# Altium project TIDM_TM4C129CAMERA.PrjPcb
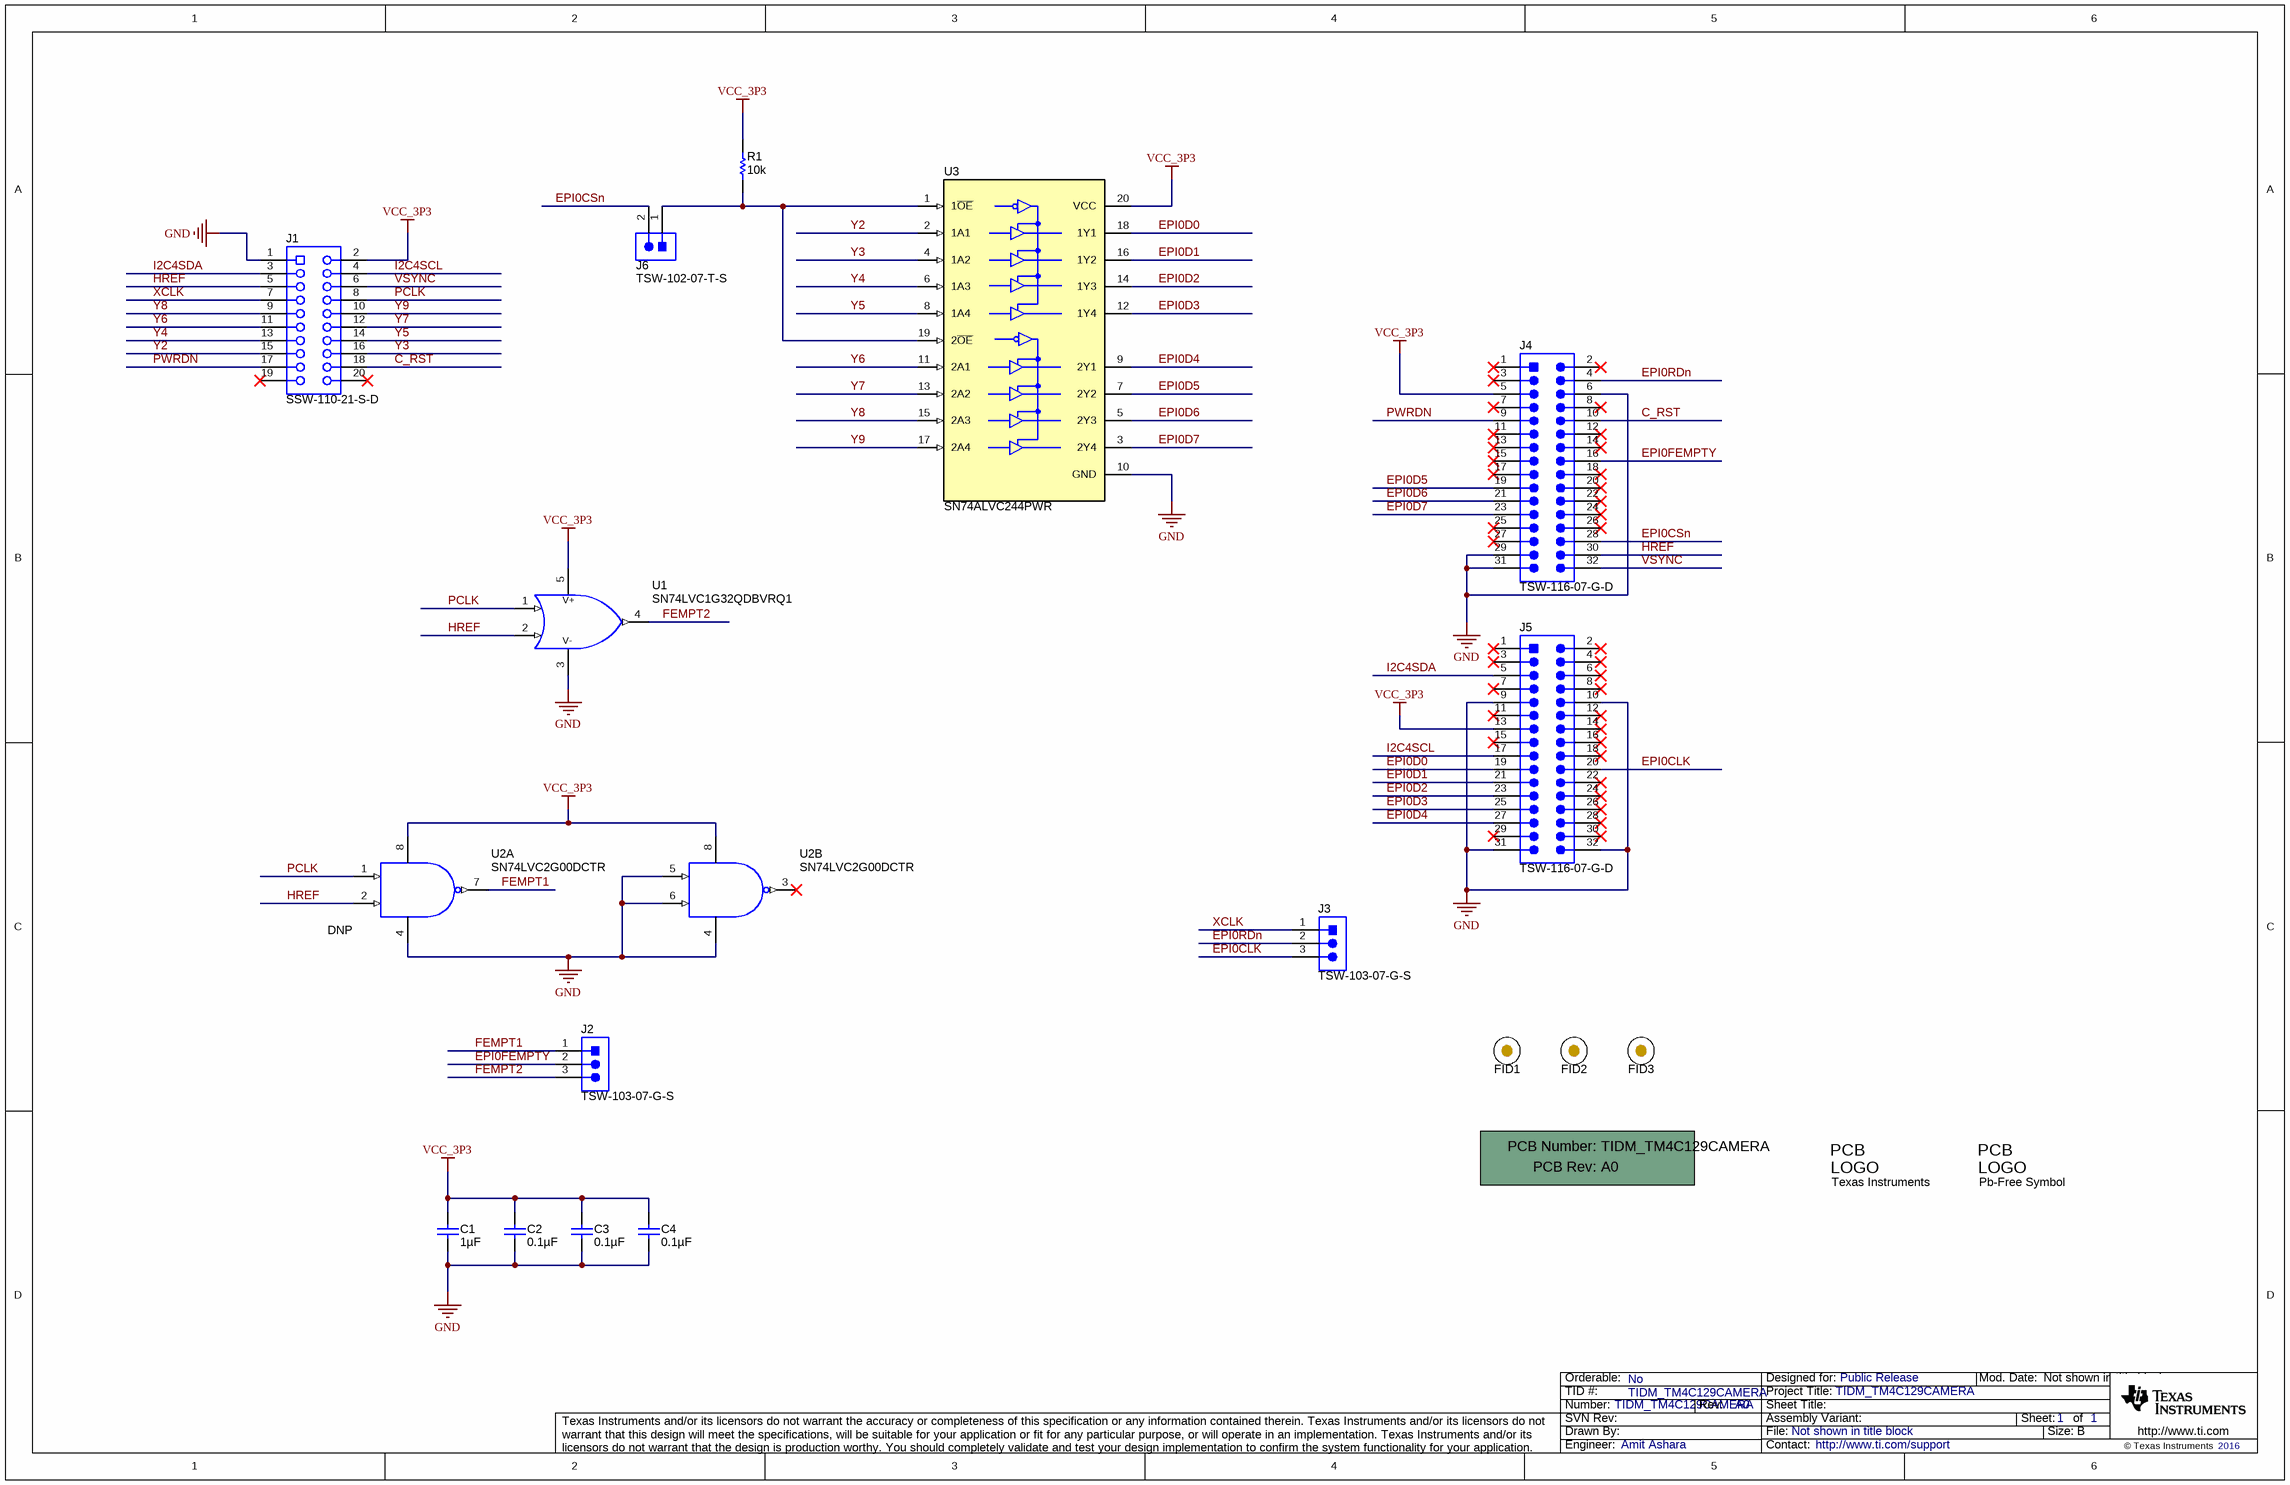
[diagram p0: TIDM_TM4C129CAMERA.SchDoc]
CopyrightYear: 2016; EVM_Orderable: No; PCB_Layout: Amit Ashara; PCB_Rev: A0; PRJ_Customer: Public Release; PRJ_Engineer: Amit Ashara; PRJ_Number: TIDM_TM4C129CAMERA; PRJ_Title: TIDM_TM4C129CAMERA; SCH_Rev: A0; TechSupport: http://www.ti.com/support; TID: TIDM_TM4C129CAMERA
1 sheet, 20 parts. Net scope: global (net labels, ports and power ports of the same name join across sheets).
Board file: TIDM_TM4C129CAMERA.PcbDoc

## Sheet TIDM_TM4C129CAMERA.SchDoc
size 431 x 279 mm; Date: Not shown in title block; ApprovedBy: Not shown in title block; CheckedBy: Not shown in title block; Author: Not shown in title block; CompanyName: Not shown in title block; Engineer: Not shown in title block; Organization: Not shown in title block; Address1: Not shown in title block; Address2: Not shown in title block; Address3: Not shown in title block; Address4: Not shown in title block; DocumentNumber: 1; Revision: Use project parameter SCH_Rev; SheetNumber: 1; SheetTotal: 1; PageSetup: Record=PageOptions|CenterHorizontal=True|CenterVertical=True|PrintScale=1.00|XCorrection=1.00|YCorrection=1.00|PrintKind=0|BorderSize=5000000|LeftOffset=0|BottomOffset=0|Orientation=2|PaperLength=1000|PaperWidth=1000|Scale=100|PaperSource=15|PrintQuality=600|MediaType=1|DitherType=10|PaperKind=Letter|PrintScaleMode=1; CurrentTime: Not shown in title block; CurrentDate: Not shown in title block; Time: Not shown in title block; DocumentFullPathAndName: Not shown in title block; DocumentName: Not shown in title block; ModifiedDate: Not shown in title block; ImagePath: Not shown in title block

### Parts
!PCB  Printed Circuit Board  (value not drawn)  (mechanical)
C1  ValueDisplayed: 1µF  [0603]  (hidden comment: GRM188R71A105KA61D)
C2  ValueDisplayed: 0.1µF  [0603]  (hidden comment: C0603C104K8RACTU)
C3  ValueDisplayed: 0.1µF  [0603]  (hidden comment: C0603C104K8RACTU)
C4  ValueDisplayed: 0.1µF  [0603]  (hidden comment: C0603C104K8RACTU)
FID1  Fiducial  [Fiducial10-20]  (value not drawn)
FID2  Fiducial  [Fiducial10-20]  (value not drawn)
FID3  Fiducial  [Fiducial10-20]  (value not drawn)
J1  SSW-110-21-S-D  [Samtec_SSW-110-x1-x-D]
J2  TSW-103-07-G-S  [TSW-103-07-G-S]
J3  TSW-103-07-G-S  [TSW-103-07-G-S]
J4  TSW-116-07-G-D  [TSW-116-07-G-D]
J5  TSW-116-07-G-D  [TSW-116-07-G-D]
J6  TSW-102-07-T-S  [Samtec_TSW-102-07-T-S]
Logo1  Texas Instruments  [TI_Stacked_Overlay_Small]  (no BOM)
Logo2  Pb-Free Symbol  [Pb-Free_Overlay_Small]  (no BOM)
R1  ValueDisplayed: 10k  [0603]  (hidden comment: CRCW060310K0JNEA)
U1  SN74LVC1G32QDBVRQ1  [DBV0005A_N]
U2  SN74LVC2G00DCTR  [DCT0008A_N]  (parts A,B of 2)
U3  SN74ALVC244PWR  [PW0020A_N]

### Nets
GND: C1.2 C2.2 C3.2 C4.2 J1.1 J4.6 J4.29 J4.31 J5.9 J5.10 J5.31 J5.32 U1.3(GND) U2.4(GND) U2.5(2A) U2.6(2B) U3.10(GND)
VCC_3P3: C1.1 C2.1 C3.1 C4.1 J1.2 J4.5 J5.13 R1.2 U1.5(VCC) U2.8(VCC) U3.20(VCC)
C_RST: J1.18 J4.10
EPI0CLK: J3.3 J5.20
EPI0CSn: J4.28 J6.2
EPI0D0: J5.19 U3.18(1Y1)
EPI0D1: J5.21 U3.16(1Y2)
EPI0D2: J5.23 U3.14(1Y3)
EPI0D3: J5.25 U3.12(1Y4)
EPI0D4: J5.27 U3.9(2Y1)
EPI0D5: J4.19 U3.7(2Y2)
EPI0D6: J4.21 U3.5(2Y3)
EPI0D7: J4.23 U3.3(2Y4)
EPI0FEMPTY: J2.2 J4.16
EPI0RDn: J3.2 J4.4
FEMPT1: J2.1 U2.7(1Y)
FEMPT2: J2.3 U1.4(Y)
HREF: J1.5 J4.30 U1.2(B) U2.2(1B)
I2C4SCL: J1.4 J5.17
I2C4SDA: J1.3 J5.5
PCLK: J1.8 U1.1(A) U2.1(1A)
PWRDN: J1.17 J4.9
VSYNC: J1.6 J4.32
XCLK: J1.7 J3.1
Y2: J1.15 U3.2(1A1)
Y3: J1.16 U3.4(1A2)
Y4: J1.13 U3.6(1A3)
Y5: J1.14 U3.8(1A4)
Y6: J1.11 U3.11(2A1)
Y7: J1.12 U3.13(2A2)
Y8: J1.9 U3.15(2A3)
Y9: J1.10 U3.17(2A4)
NetJ6_1: J6.1 R1.1 U3.1(1~{OE}) U3.19(2~{OE})

Not connected (* = marked no-connect by the designer): J1 19* 20*; J4 1* 2* 3* 7* 8* 11* 12* 13* 14* 15* 17* 18* 20* 22* 24* 25* 26* 27*; J5 1* 2* 3* 4* 6* 7* 8* 11* 12* 14* 15* 16* 18* 22* 24* 26* 28* 29* 30*; U2 3(2Y)*

### Notes on the sheet
- (near U2) DNP
- Drawn By:
- SVN Rev:
- Number:
- TID #:
- Orderable:
- Rev:
- Sheet Title:
- File:
- Project Title:
- Designed for:
- Assembly Variant:
- Mod. Date:
- Sheet:
- Size:
- of
- B
- http://www.ti.com
- Texas Instruments and/or its licensors do not warrant the accuracy or completeness of this specification or any information contained therein. Texas Instruments and/or its licensors do not warrant that this design will meet the specifications, will be suitable for your application or fit for any particular purpose, or will operate in an implementation. Texas Instruments and/or its licensors do not warrant that the design is production worthy. You should completely validate and test your design implementation to confirm the system functionality for your application.
- Engineer:
- Contact:
- © Texas Instruments
- (in symbol Pb-Free) PCB; LOGO
- (in symbol PCB) PCB Number:; PCB Rev:
- (in symbol SN74LVC1G32QDBVRQ1) V+; V-
- (in symbol TI_Logo) PCB; LOGO

### Library data of the parts
!PCB = PCB: Manufacturer: Any; PartNumber: TIDM_TM4C129CAMERA; SymbolCreator: a0412235; SymbolVersion: 2012-05-30; CompType: PCB; RoHS: O; MountType: N/A; Publisher: Texas Instruments; LatestRevisionDate: 2012-06-27; LatestRevisionNote: Initial Version; Alternate Manufacturer: -; Alternate PartNumber: -
C1 = GRM188R71A105KA61D: CAP, CERM, 1 µF, 10 V, +/- 10%, X7R, 0603; Manufacturer: MuRata; Polarized: N; CompType: Capacitor; Value: 1uF; U/M: EA; Cap_F: 0.000001; Tolerance_%: 10; ESR_ohm: 0.011; Value1: 0.011 ohm; Value2: 10V; TaMin_C: -55; TaMax_C: 125; AEC Category: Q200; SymbolVersion: 2008-07-09; PartNumber: GRM188R71A105KA61D; PackageReference: 0603; RoHS: Y; VDC_V: 10; MountType: SMT; Technology: Ceramic; TempCo: X7R; Cap_Case: 0603; Published: 2008-06-19; Publisher: Texas Instruments; LatestRevisionDate: 2016-02-23; ComponentLink1Description: Datasheet link; ComponentLink1URL: http://search.murata.co.jp/Ceramy/PnsearchViewAction.do?HnOFG=ON&HnNFG=ON&SEL_CNT=50&sLang=en&sKey=GRM188R71A105KA61D&x=9&y=9&search=startwith; Supplier 1: Digi-Key; Supplier Part Number 1: 490-3899-1-ND; Supplier 2: Mouser; Supplier Part Number 2: 81-GRM188R71A105KA1D; Supplier 3: Farnell; Supplier Part Number 3: 1845766; AEC Qualified: ?
C2-C4 = C0603C104K8RACTU: CAP, CERM, 0.1 µF, 10 V, +/- 10%, X7R, 0603; Manufacturer: Kemet; Polarized: N; CompType: Capacitor; Value: 0.1uF; U/M: EA; Cap_F: 0.0000001; Tolerance_%: 10; Value1: Unknown; Value2: 10V; TaMin_C: -55; TaMax_C: 125; AEC Category: Q200; SymbolVersion: 2008-07-09; PartNumber: C0603C104K8RACTU; PackageReference: 0603; RoHS: Y; VDC_V: 10; MountType: SMT; Technology: Ceramic; TempCo: X7R; Cap_Case: 0603; Published: 2008-06-19; Publisher: Texas Instruments; LatestRevisionDate: 2016-02-23; ComponentLink1Description: Datasheet link; ComponentLink1URL: http://www.kemet.com/kemet/web/homepage/kechome.nsf/vapubfiles/F3102_Y5V.pdf/$file/F3102_Y5V.pdf; Supplier 1: Digi-Key; Supplier Part Number 1: 399-1095-1-ND; Supplier 2: Mouser; Supplier Part Number 2: 80-C0603C104K8R; Supplier 3: Farnell; Supplier Part Number 3: 1640032; AEC Qualified: ?
FID1-FID3 = Fiducial: Fiducial mark.  There is nothing to buy or mount.; SymbolCreator: codlsc; SymbolVersion: 2009-11-4; CompType: Fiducial; Publisher: Texas Instruments; LatestRevisionDate: 2014-08-01; LatestRevisionNote: Added Alternate PartNumber and Alternate Manufacturer parameters to appropriate components.; Manufacturer: N/A; MountType: N/A; PackageReference: Fiducial; PartNumber: N/A; ClassName: FiducialMark
J1 = SSW-110-21-S-D: Receptacle, 2.54mm, 10x2, Gold, TH; Manufacturer: Samtec; SymbolCreator: a0412235; Pitch_mm: 2.54; Gender: Female; Row_Count: 2; SymbolVersion: 2013-12-20; PartNumber: SSW-110-21-S-D; PackageReference: Receptacle, 2.54mm, 10x2, TH; CompType: Receptacle; RoHS: Y; MountType: TH; ComponentLink1Description: Datasheet URL; ComponentLink1URL: https://www.samtec.com/ftppub/cpdf/SSW-1XX-XX-XXX-X-XX-XXX-XX-MKT.pdf; Orientation: Vertical; PinCount: 20; RowSpacing_mm: 2.54; ContactFinish: Gold; Color: Black; Publisher: Texas Instruments; LatestRevisionDate: 2016-02-25; Supplier 1: Digi-Key; Supplier Part Number 1: SAM1223-10-ND
J2 J3 = TSW-103-07-G-S: Header, 100mil, 3x1, Gold, TH; Manufacturer: Samtec; SymbolCreator: a0799628; Pitch_mm: 2.54; Gender: Male; Shrouded: N; Row_Count: 1; Current_A: 6.3; Voltage_V: 550; Cert_CSA: Y; SymbolVersion: 2013-03-28; PartNumber: TSW-103-07-G-S; PackageReference: 3x1 Header; ClassName: Header; CompType: Header; RoHS: Y; MountType: TH; ComponentLink1Description: Datasheet URL; ComponentLink1URL: http://samtec.com/ftppub/pdf/TSW_TH.PDF; Orientation: Vertical; PinCount: 3; ContactFinish: Gold; Color: Black; Cert_UL: Y; Cert_CULUS: N; Cert_VDE: N; Publisher: Texas Instruments; LatestRevisionDate: 2016-02-25; Supplier 1: Digi-Key; Supplier Part Number 1: SAM1029-03-ND
J4 J5 = TSW-116-07-G-D: Header, 100mil, 16x2, Gold, TH; Manufacturer: Samtec; SymbolCreator: a0412235; Pitch_mm: 2.54; Gender: Male; Shrouded: N; Row_Count: 2; Current_A: 6.3; Voltage_V: 550; Cert_CSA: Y; SymbolVersion: 2013-12-22; PartNumber: TSW-116-07-G-D; PackageReference: 16x2 Header; ClassName: Header; CompType: Header; RoHS: Y; MountType: TH; ComponentLink1Description: Datasheet URL; ComponentLink1URL: http://samtec.com/ftppub/pdf/TSW_TH.PDF; Orientation: Vertical; PinCount: 32; RowSpacing_mm: 2.54; ContactFinish: Gold; Color: Black; Cert_UL: Y; Cert_CULUS: N; Cert_VDE: N; Publisher: Texas Instruments; LatestRevisionDate: 2016-02-25; Supplier 1: Digi-Key; Supplier Part Number 1: SAM1028-16-ND
J6 = TSW-102-07-T-S: Header, 2.54 mm, 2x1, Tin, TH; Manufacturer: Samtec; SymbolCreator: a0412235; Pitch_mm: 2.54; Gender: Male; Shrouded: N; Row_Count: 1; Current_A: 6.3; Voltage_V: 550; Cert_CSA: Y; SymbolVersion: 2013-10-31; PartNumber: TSW-102-07-T-S; PackageReference: Header, 2.54 mm, 2x1, TH; ClassName: Header; CompType: Header; RoHS: Y; MountType: TH; ComponentLink1Description: Datasheet URL; ComponentLink1URL: http://www.samtec.com/documents/webfiles/pdf/TSW_TH.PDF; Orientation: Vertical; PinCount: 2; ContactFinish: Tin; Color: Black; Cert_UL: Y; Cert_CULUS: N; Cert_VDE: N; Publisher: Texas Instruments; LatestRevisionDate: 2016-02-25; Supplier 1: Digi-Key; Supplier Part Number 1: SAM1035-02-ND
Logo1 = TI_Logo: Texas Instrument Corporate Signature; SymbolCreator: codlsc; SymbolVersion: 2011-08-22; Published: 2009-03-03; Publisher: National Semiconductor; ClassName: Logo; LatestRevisionDate: 2011-10-25; LatestRevisionNote: Added ClassName of Logo.
Logo2 = Pb-Free: SymbolCreator: a0412235; SymbolVersion: 2011-08-22; Published: 2009-03-03; Publisher: Texas Instruments; LatestRevisionDate: 2014-08-05
R1 = CRCW060310K0JNEA: RES, 10 k, 5%, 0.1 W, 0603; Manufacturer: Vishay-Dale; CompType: Resistor; Value: 10k; Res_ohm: 10000; Value_Code: 10k0; Tolerance_%: 5; Power_W: 0.1; Value2: 0.1W; VDC_V: 75; TempCo: 200 ppm/C; EIA_Code: E24; U/M: EA; AEC Category: Q200; SymbolVersion: 2009-05-29; PartNumber: CRCW060310K0JNEA; PackageReference: 0603; RoHS: Y; Value1: 5%; MountType: SMT; Technology: Thick Film; Published: 2008-06-26; Publisher: Texas Instruments; LatestRevisionDate: 2016-02-20; ComponentLink1Description: Datasheet link; ComponentLink1URL: http://www.vishay.com/docs/20035/dcrcwe3.pdf; Supplier 1: Digi-Key; Supplier Part Number 1: 541-10KGCT-ND; Supplier 2: Mouser; Supplier Part Number 2: 71-CRCW0603J-10K-E3; Supplier 3: Farnell; Supplier Part Number 3: 1469749; AEC Qualified: ?
U1 = SN74LVC1G32QDBVRQ1: SINGLE 2-INPUT POSITIVE-OR GATE, DBV0005A; Manufacturer: Texas Instruments; SymbolCreator: a0411947; CompType: IC; U/M: EA; SymbolVersion: 2013-08-09; PartNumber: SN74LVC1G32QDBVRQ1; PackageReference: DBV0005A; MountType: SMT; ComponentLink1Description: Datasheet Link; ComponentLink1URL: http://www.ti.com/lit/ds/symlink/sn74lvc1g32-q1.pdf; RoHS: Y; Publisher: Texas Instruments; LatestRevisionDate: 2016-02-12; Alternate Manufacturer: Texas Instruments
U2 = SN74LVC2G00DCTR: Dual 2-Input Positive-NAND Gate, DCT0008A; Manufacturer: Texas Instruments; SymbolCreator: a0411947; CompType: IC; U/M: EA; SymbolVersion: 2014-09-18; PartNumber: SN74LVC2G00DCTR; PackageReference: DCT0008A; MountType: SMT; ComponentLink1Description: Datasheet Link; ComponentLink1URL: http://www.ti.com/lit/ds/symlink/sn74lvc2g00.pdf; RoHS: Y; Publisher: Texas Instruments; LatestRevisionDate: 2016-02-12; Alternate Manufacturer: Texas Instruments
U3 = SN74ALVC244PWR: OCTAL BUFFER/DRIVER WITH 3-STATE OUTPUTS, PW0020A; Manufacturer: Texas Instruments; SymbolCreator: Altium; CompType: IC; U/M: EA; SymbolVersion: 2015-08-13; PartNumber: SN74ALVC244PWR; Alternate PartNumber: SN74ALVC244PW; PackageReference: PW0020A; MountType: SMT; ComponentLink1Description: Datasheet Link; ComponentLink1URL: http://www.ti.com/lit/ds/symlink/sn74alvc244.pdf; RoHS: Y; Publisher: Texas Instruments; LatestRevisionDate: 2016-02-25; Alternate Manufacturer: Texas Instruments

## Assembly variants
001: not fitted FID1 FID2 FID3